# Altium schematic sheet PowerRegulation.SchDoc
size 381 x 241 mm
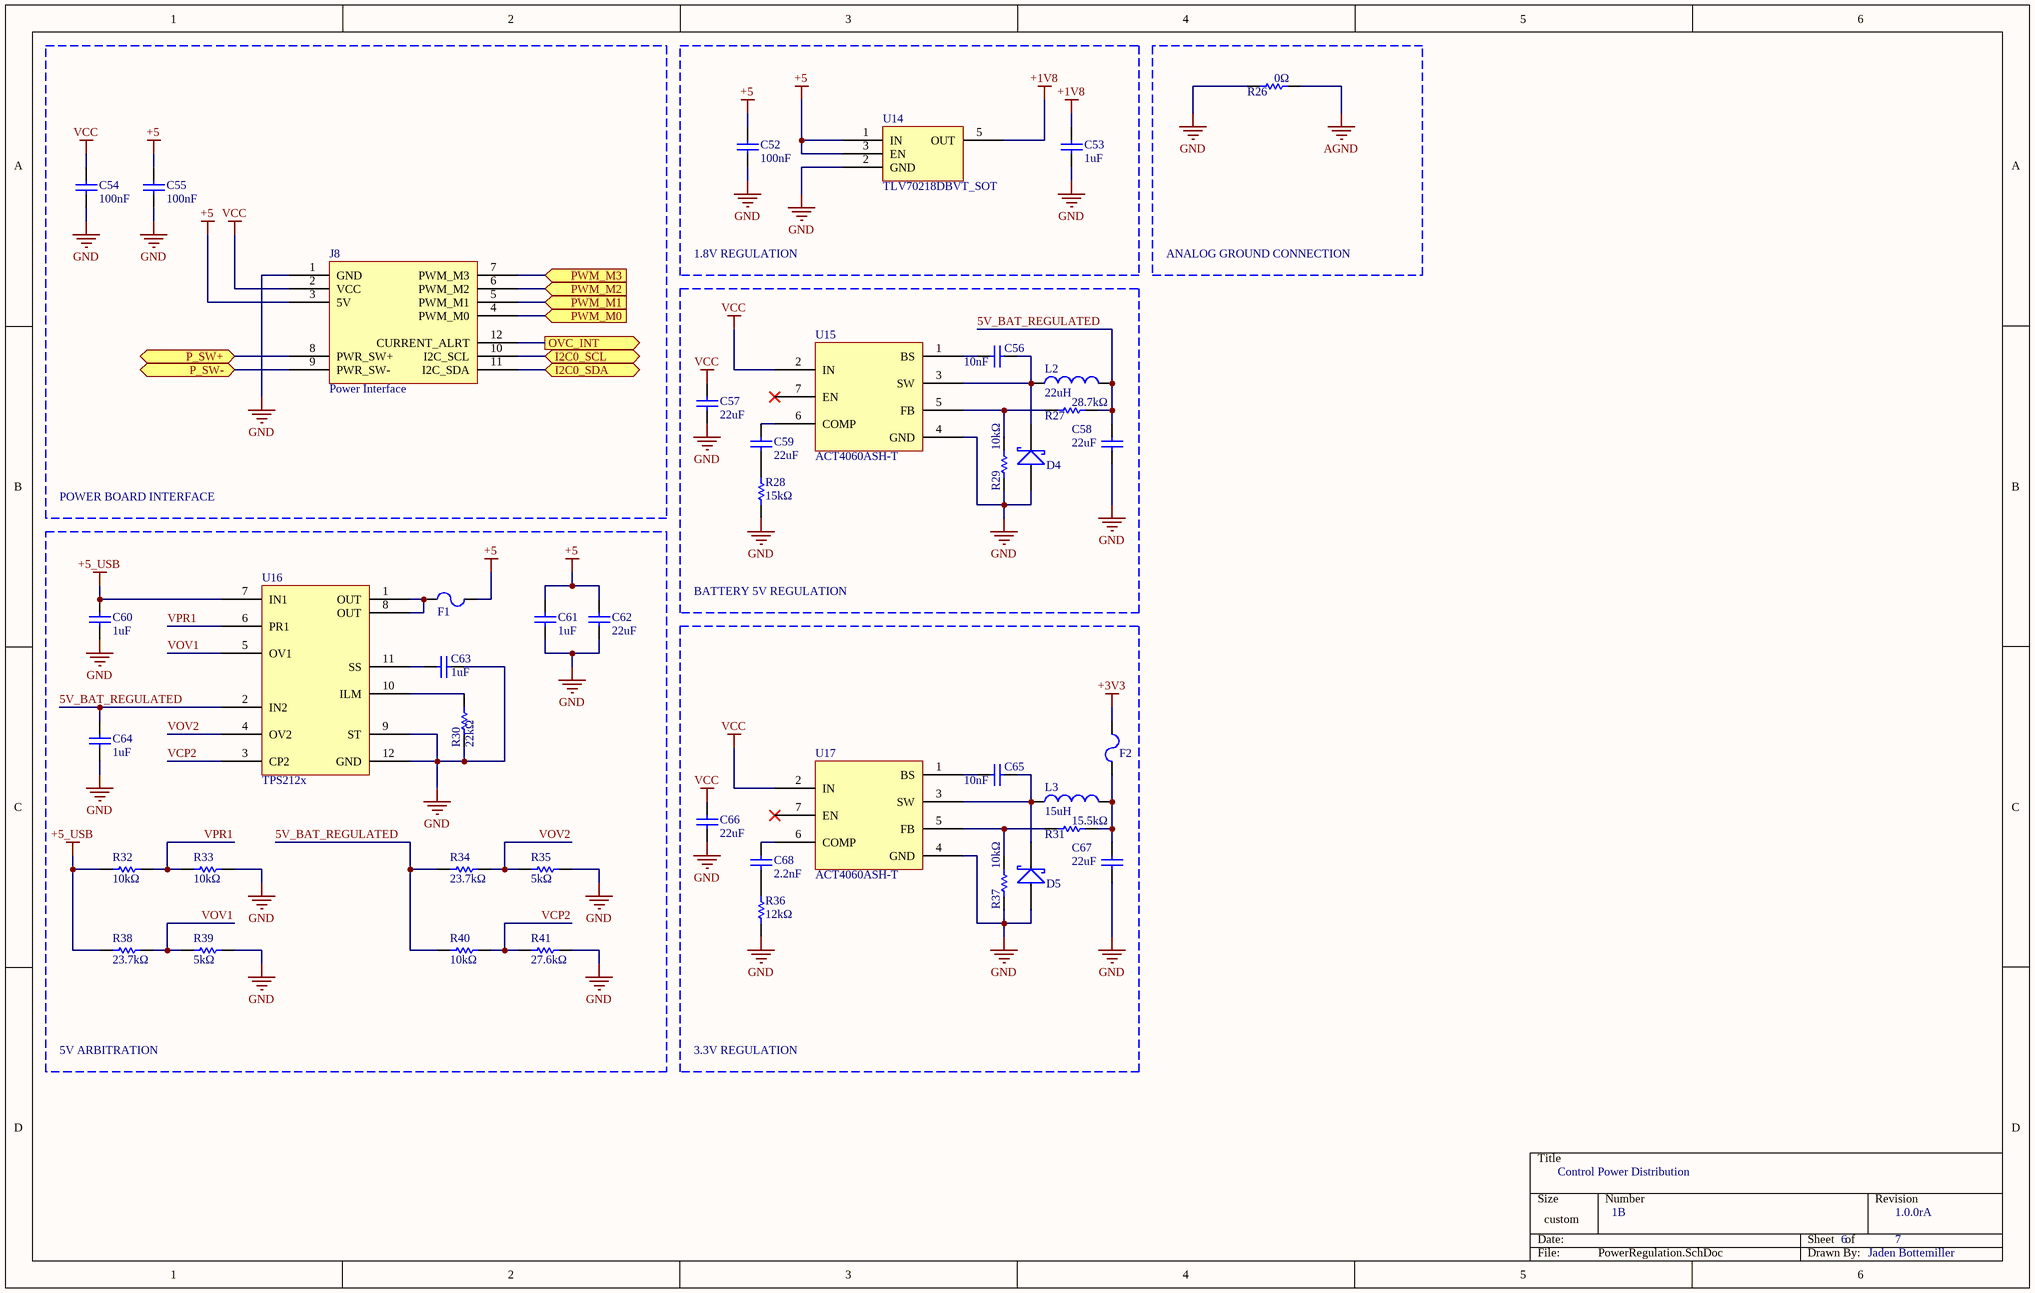
[diagram p0: PowerRegulation.SchDoc]

## Parts
C52  value 100nF  (hidden comment: CAP)
C53  value 1uF  (hidden comment: CAP)
C54  value 100nF  (hidden comment: CAP)
C55  value 100nF  (hidden comment: CAP)
C56  value 10nF  (hidden comment: CAP)
C57  value 22uF  (hidden comment: CAP)
C58  value 22uF  (hidden comment: CAP)
C59  value 22uF  (hidden comment: CAP)
C60  value 1uF  (hidden comment: CAP)
C61  value 1uF  (hidden comment: CAP)
C62  value 22uF  (hidden comment: CAP)
C63  value 1uF  (hidden comment: CAP)
C64  value 1uF  (hidden comment: CAP)
C65  value 10nF  (hidden comment: CAP)
C66  value 22uF  (hidden comment: CAP)
C67  value 22uF  (hidden comment: CAP)
C68  value 2.2nF  (hidden comment: CAP)
D4  Schottky Diode  (value not drawn)
D5  Schottky Diode  (value not drawn)
F1  FUSE  (value not drawn)
F2  FUSE  (value not drawn)
J8  Power Interface
L2  value 22uH  (hidden comment: IND)
L3  value 15uH  (hidden comment: IND)
R26  value 0Ω  (hidden comment: RES)
R27  value 28.7kΩ  (hidden comment: RES)
R28  value 15kΩ  (hidden comment: RES)
R29  value 10kΩ  (hidden comment: RES)
R30  value 22kΩ  (hidden comment: RES)
R31  value 15.5kΩ  (hidden comment: RES)
R32  value 10kΩ  (hidden comment: RES)
R33  value 10kΩ  (hidden comment: RES)
R34  value 23.7kΩ  (hidden comment: RES)
R35  value 5kΩ  (hidden comment: RES)
R36  value 12kΩ  (hidden comment: RES)
R37  value 10kΩ  (hidden comment: RES)
R38  value 23.7kΩ  (hidden comment: RES)
R39  value 5kΩ  (hidden comment: RES)
R40  value 10kΩ  (hidden comment: RES)
R41  value 27.6kΩ  (hidden comment: RES)
U14  TLV70218DBVT_SOT
U15  ACT4060ASH-T
U16  TPS212x
U17  ACT4060ASH-T

## Blocks framed on the sheet
POWER BOARD INTERFACE: C54 C55 J8
1.8V REGULATION: C52 C53 U14
ANALOG GROUND CONNECTION: R26
BATTERY 5V REGULATION: C56-C59 D4 L2 R27-R29 U15
5V ARBITRATION: C60-C64 F1 R30 R32-R35 R38-R41 U16
3.3V REGULATION: C65-C68 D5 F2 L3 R31 R36 R37 U17

## Ports
I2C0_SCL (bidir), I2C0_SDA (bidir), OVC_INT (out), P_SW+ (bidir), P_SW- (bidir), PWM_M0 (in), PWM_M1 (in), PWM_M2 (in), PWM_M3 (in)

## Nets
+1V8: C53.2 U14.5(OUT)
+3V3: F2.2
+5: C52.2 C55.2 C61.1 C62.1 F1.2 J8.3(5V) U14.1(IN) U14.3(EN)
+5_USB: C60.1 R32.2 R38.2 U16.7(IN1)
AGND: R26.1
GND: C52.1 C53.1 C54.1 C55.1 C57.1 C58.1 C60.2 C61.2 C62.2 C63.1 C64.2 C66.1 C67.1 D4.2(A) D5.2(A) J8.1(GND) R26.2 R28.1 R29.2 R30.1 R33.1 R35.1 R36.1 R37.2 R39.1 R41.1 U14.2(GND) U15.4(GND) U16.9(ST) U16.12(GND) U17.4(GND)
VCC: C54.2 C57.2 C66.2 J8.2(VCC) U15.2(IN) U17.2(IN)
5V_BAT_REGULATED: C58.2 C64.1 L2.2 R27.1 R34.2 R40.2 U16.2(IN2)
I2C0_SCL: J8.10(I2C_SCL) ; port I2C0_SCL
I2C0_SDA: J8.11(I2C_SDA) ; port I2C0_SDA
OVC_INT: J8.12(CURRENT_ALRT) ; port OVC_INT
P_SW+: J8.8(PWR_SW+) ; port P_SW+
P_SW-: J8.9(PWR_SW-) ; port P_SW-
PWM_M0: J8.4(PWM_M0) ; port PWM_M0
PWM_M1: J8.5(PWM_M1) ; port PWM_M1
PWM_M2: J8.6(PWM_M2) ; port PWM_M2
PWM_M3: J8.7(PWM_M3) ; port PWM_M3
VCP2: R40.1 R41.2 U16.3(CP2)
VOV1: R38.1 R39.2 U16.5(OV1)
VOV2: R34.1 R35.2 U16.4(OV2)
VPR1: R32.1 R33.2 U16.6(PR1)
NetC56_1: C56.1 U15.1(BS)
NetC56_2: C56.2 D4.1(K) L2.1 U15.3(SW)
NetC59_1: C59.1 R28.2
NetC59_2: C59.2 U15.6(COMP)
NetC63_2: C63.2 U16.11(SS)
NetC65_1: C65.1 U17.1(BS)
NetC65_2: C65.2 D5.1(K) L3.1 U17.3(SW)
NetC67_2: C67.2 F2.1 L3.2 R31.1
NetC68_1: C68.1 R36.2
NetC68_2: C68.2 U17.6(COMP)
NetF1_1: F1.1 U16.1(OUT) U16.8(OUT)
NetR27_2: R27.2 R29.1 U15.5(FB)
NetR30_2: R30.2 U16.10(ILM)
NetR31_2: R31.2 R37.1 U17.5(FB)

Not connected (* = marked no-connect by the designer): U14 4(NC); U15 7(EN)* 8(NC); U17 7(EN)* 8(NC)

## Notes on the sheet
- Control Power Distribution
- 1B
- 6
- 1.0.0rA
- 7
- Jaden Bottemiller

## Library data of the parts
C52-C68 = CAP: Standard Capacitor
D4 D5 = DIODE_SCHOTTKY: Standard Schottky Diode
F1 F2 = FUSE: Standard Fuse
J8 = PDB_INTERFACE: Interface between power board and control board.
L2 L3 = IND: Standard Inductor
R26-R41 = RES: Standard Resistor
U14 = TLV70218DBVT: Linear Voltage Regulator IC Positive Fixed 1 Output  300mA / SOT-23-5 ONLY (CHECK D/S FOR WSON); ComponentLink1Description: DigiKey; ComponentLink1URL: https://www.digikey.com/product-detail/en/texas-instruments/TLV70218DBVT/296-27889-1-ND/2425103; ComponentLink2Description: Datasheet; ComponentLink2URL: http://www.ti.com/lit/ds/symlink/tlv702.pdf
U15 U17 = ACT4060ASH-T: Buck Switching Regulator IC Positive Adjustable 1.293V 1 Output 2A; ComponentLink1Description: DigiKey; ComponentLink1URL: https://www.digikey.com/product-detail/en/active-semi-international-inc/ACT4060ASH-T/1488-1107-1-ND/7897251; ComponentLink2Description: Datasheet; ComponentLink2URL: https://active-semi.com/wp-content/uploads/ACT4060A_Datasheet.pdf
U16 = TPS212x: General Purpose PMIC - PWR MGMT BATTERY MGMT; ComponentLink1Description: DigiKey; ComponentLink1URL: https://www.digikey.com/product-detail/en/texas-instruments/TPS2121RUXR/296-53410-1-ND/9859004; ComponentLink2Description: Datasheet; ComponentLink2URL: http://www.ti.com/lit/ds/symlink/tps2120.pdf